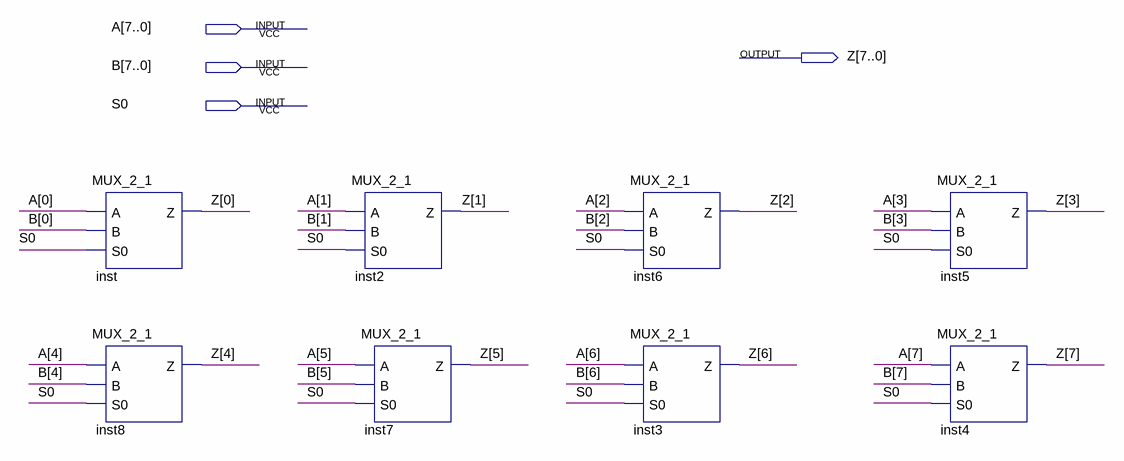
[diagram p0: schematic sheet]
// Quartus schematic MUX.bdf as structural Verilog: 8 symbols, 4 pins
module MUX (
  input  [7:0] A,
  input  [7:0] B,
  input  S0,
  output [7:0] Z
);

  MUX_2_1 inst (.A(A[0]), .B(B[0]), .S0(S0), .Z(Z[0]));
  MUX_2_1 inst8 (.A(A[4]), .B(B[4]), .S0(S0), .Z(Z[4]));
  MUX_2_1 inst2 (.A(A[1]), .B(B[1]), .S0(S0), .Z(Z[1]));
  MUX_2_1 inst7 (.A(A[5]), .B(B[5]), .S0(S0), .Z(Z[5]));
  MUX_2_1 inst6 (.A(A[2]), .B(B[2]), .S0(S0), .Z(Z[2]));
  MUX_2_1 inst3 (.A(A[6]), .B(B[6]), .S0(S0), .Z(Z[6]));
  MUX_2_1 inst5 (.A(A[3]), .B(B[3]), .S0(S0), .Z(Z[3]));
  MUX_2_1 inst4 (.A(A[7]), .B(B[7]), .S0(S0), .Z(Z[7]));
endmodule
